# EAGLE design 477 (EAGLE 9.3.2)
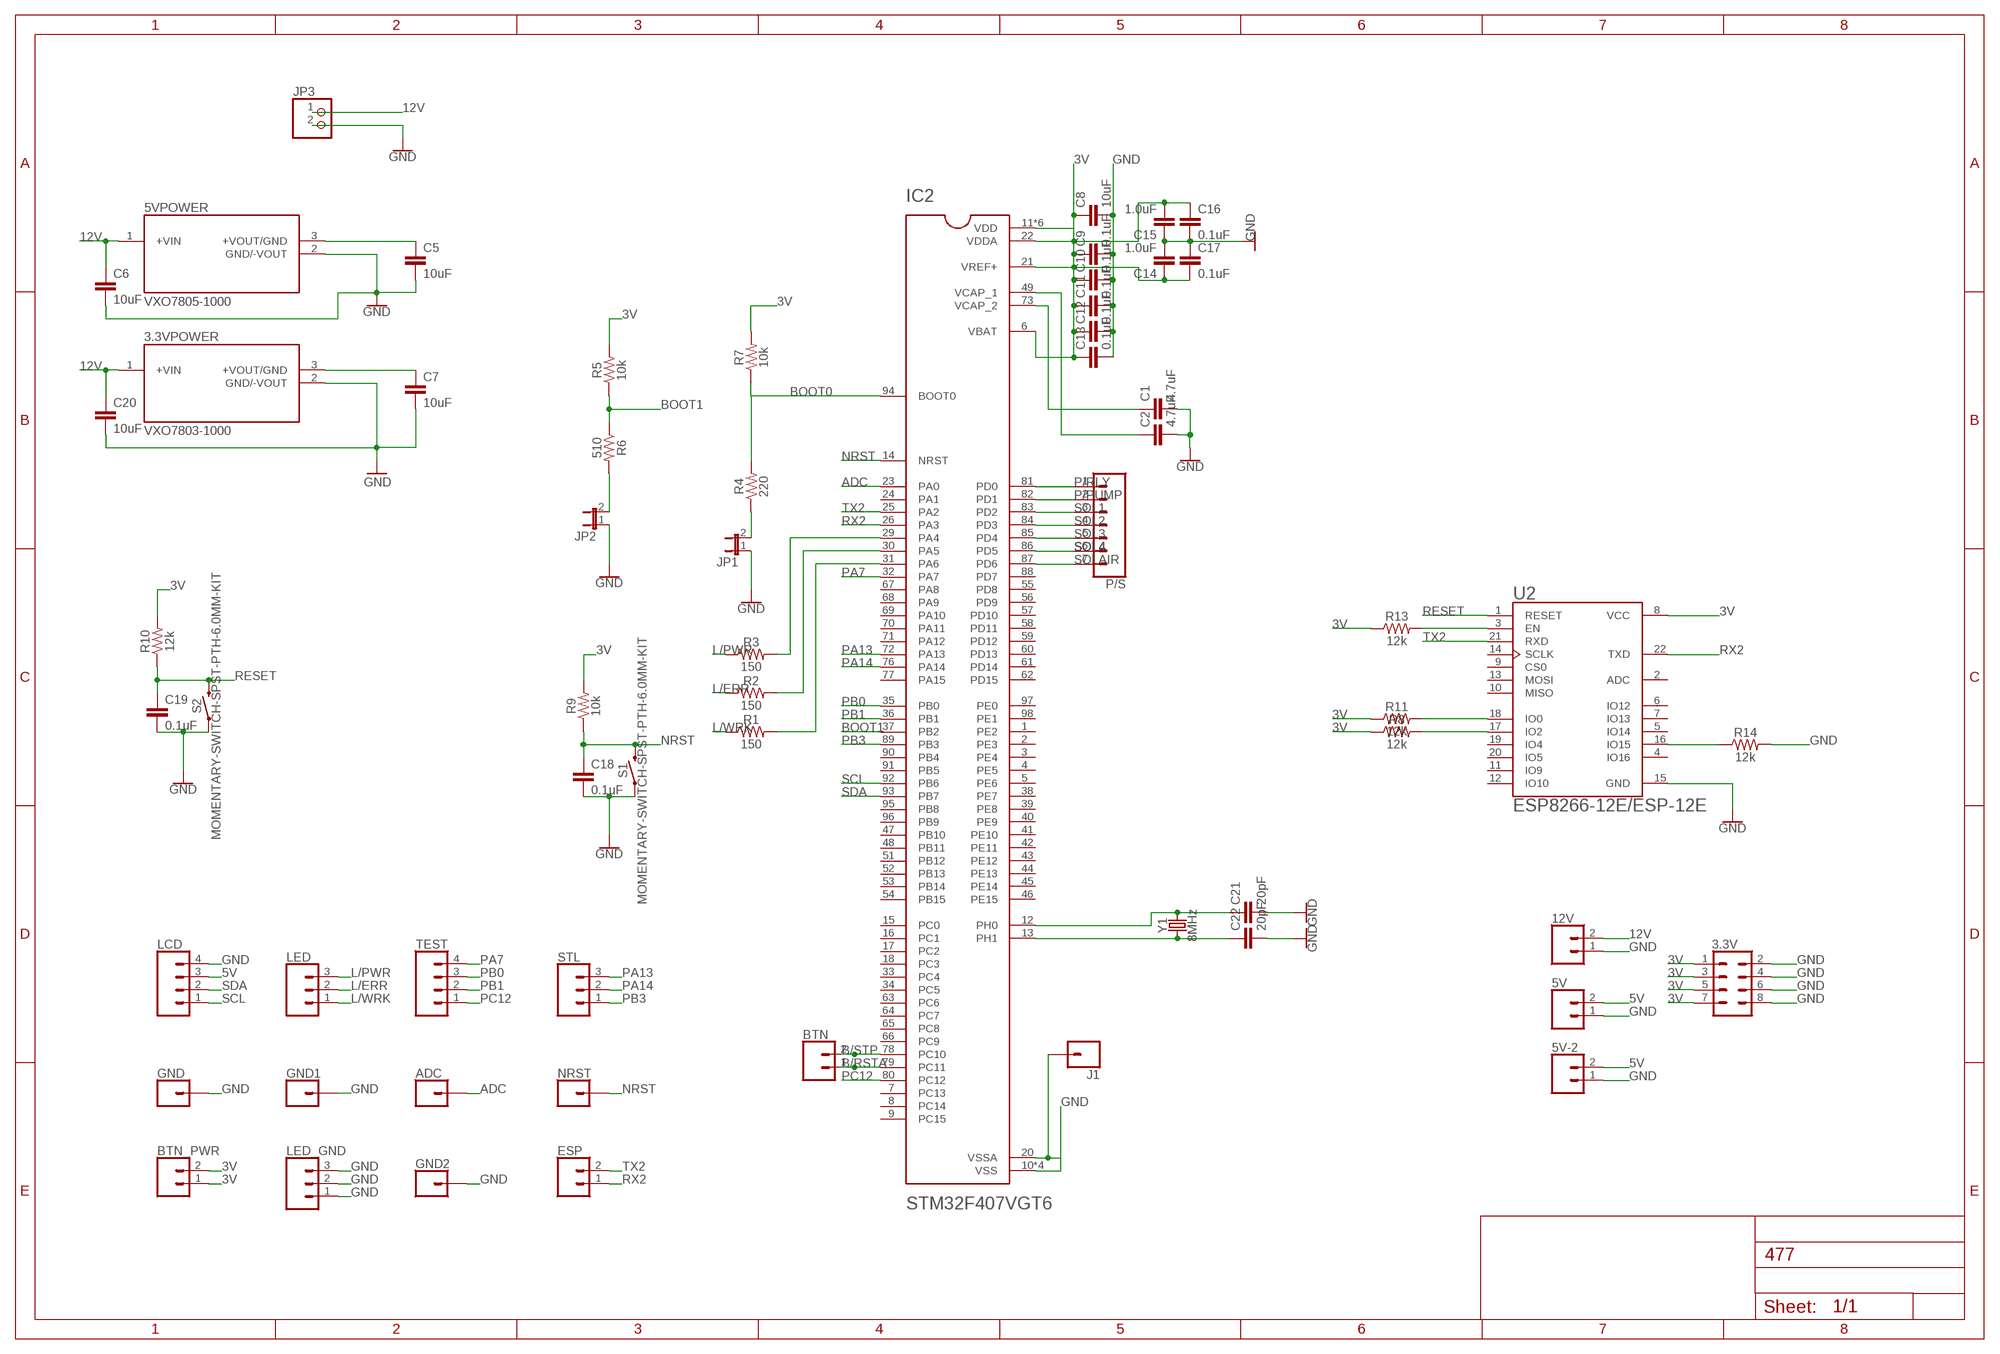
[diagram p0: schematic, sheet 1]

## Parts
3.3V  CONN_04X2  [2X4]
3.3VPOWER  VXO7803-1000  [CONV_VXO7803-1000]
5V  CONN_02  [1X02]
5V-2  CONN_02  [1X02]
5VPOWER  VXO7805-1000  [CONV_VXO7805-1000]
12V  CONN_02  [1X02]
ADC  CONN_01  [1X01]
BTN  CONN_02  [1X02]
BTN_PWR  CONN_02  [1X02]
C1  4.7uF  4.7UF0603  [0603]
C2  4.7uF  4.7UF0603  [0603]
C5  10uF  10UF-0603-6.3V-20%  [0603]
C6  10uF  10UF-0603-6.3V-20%  [0603]
C7  10uF  10UF-0603-6.3V-20%  [0603]
C8  10uF  10UF-0603-6.3V-20%  [0603]
C9  0.1uF  0.1UF-0402-16V-10%  [0402]
C10  0.1uF  0.1UF-0402-16V-10%  [0402]
C11  0.1uF  0.1UF-0402-16V-10%  [0402]
C12  0.1uF  0.1UF-0402-16V-10%  [0402]
C13  0.1uF  0.1UF-0402-16V-10%  [0402]
C14  1.0uF  1.0UF-0402-16V-10%  [0402]
C15  1.0uF  1.0UF-0402-16V-10%  [0402]
C16  0.1uF  0.1UF-0402-16V-10%  [0402]
C17  0.1uF  0.1UF-0402-16V-10%  [0402]
C18  0.1uF  0.1UF-0402-16V-10%  [0402]
C19  0.1uF  0.1UF-0402-16V-10%  [0402]
C20  10uF  10UF-0603-6.3V-20%  [0603]
C21  20pF  18PF-0603-50V-5%  [0603]
C22  20pF  18PF-0603-50V-5%  [0603]
ESP  CONN_02  [1X02]
GND  CONN_01PTH_NO_SILK_YES_STOP  [1X01_NO_SILK]
GND1  CONN_01PTH_NO_SILK_YES_STOP  [1X01_NO_SILK]
GND2  CONN_01  [1X01]
IC2  STM32F407VGT6  [QFP50P1600X1600X160-100N]
J1  CONN_01PTH_NO_SILK_YES_STOP  [1X01_NO_SILK]
JP1  JP1E  [JP1]
JP2  JP1E  [JP1]
JP3  PINHD-1X2  [1X02]
LCD  CONN_04  [1X04]
LED  CONN_03  [1X03]
LED_GND  CONN_03  [1X03]
NRST  CONN_01  [1X01]
P/S  CONN_07  [1X07]
R1  150  150OHM-0603-1/10W-1%  [0603]
R2  150  150OHM-0603-1/10W-1%  [0603]
R3  150  150OHM-0603-1/10W-1%  [0603]
R4  220  220OHM-0603-1/10W-1%  [0603]
R5  10k  1KOHM-0603-1/10W-1%  [0603]
R6  510  0.05OHM-0603-1/5W-1%  [0603]
R7  10k  10KOHM-0603-1/10W-1%  [0603]
R8  12k  12KOHM-0603-1/10W-1%  [0603]
R9  10k  10KOHM-0603-1/10W-1%  [0603]
R10  12k  12KOHM-0603-1/10W-1%  [0603]
R11  12k  12KOHM-0603-1/10W-1%  [0603]
R13  12k  12KOHM-0603-1/10W-1%  [0603]
R14  12k  12KOHM-0603-1/10W-1%  [0603]
S1  MOMENTARY-SWITCH-SPST-PTH-6.0MM-KIT  [TACTILE_SWITCH_PTH_6.0MM_KIT]
S2  MOMENTARY-SWITCH-SPST-PTH-6.0MM-KIT  [TACTILE_SWITCH_PTH_6.0MM_KIT]
STL  CONN_03  [1X03]
TEST  CONN_04  [1X04]
U2  ESP8266-12E/ESP-12E  [XCVR_ESP8266-12E/ESP-12E]
Y1  8MHz  CRYSTAL-8MHZSMD-HC49UP  [HC49UP]

## Nets
3V: 3.3V.1 3.3V.3 3.3V.5 3.3V.7 3.3VPOWER.3(+VOUT/GND) BTN_PWR.1 BTN_PWR.2 C7.1 C8.1 C9.1 C10.1 C11.1 C12.1 C13.1 C14.1 C15.2 C16.1 C17.2 IC2.6(VBAT) IC2.11(VDD) IC2.19(VDD) IC2.21(VREF+) IC2.22(VDDA) IC2.28(VDD) IC2.50(VDD) IC2.75(VDD) IC2.100(VDD) R5.2 R7.2 R8.1 R9.2 R10.2 R11.1 R13.1 U2.8(VCC)
5V: 5V-2.2 5V.2 5VPOWER.3(+VOUT/GND) C5.1 LCD.3
12V: 3.3VPOWER.1(+VIN) 5VPOWER.1(+VIN) 12V.2 C6.1 C20.1 JP3.1
ADC [sig]: ADC.1 IC2.23(PA0)
B/RSTA [sig]: BTN.1 IC2.79(PC11)
B/STP [sig]: BTN.2 IC2.78(PC10)
BOOT0 [sig]: IC2.94(BOOT0) R4.2 R7.1
BOOT1 [sig]: IC2.37(PB2) R5.1 R6.1
EN: R13.2 U2.3(EN)
GND: 3.3V.2 3.3V.4 3.3V.6 3.3V.8 3.3VPOWER.2(GND/-VOUT) 5V-2.1 5V.1 5VPOWER.2(GND/-VOUT) 12V.1 C1.2 C2.2 C5.2 C6.2 C7.2 C8.2 C9.2 C10.2 C11.2 C12.2 C13.2 C14.2 C15.1 C16.2 C17.1 C18.2 C19.2 C20.2 C21.2 C22.2 GND1.1 GND2.1 GND.1 IC2.10(VSS) IC2.27(VSS) IC2.74(VSS) IC2.99(VSS) JP1.1 JP2.1 JP3.2 LCD.4 LED_GND.1 LED_GND.2 LED_GND.3 R14.2 S1.1 S2.1 U2.15(GND)
L/ERR [sig]: LED.2 R2.1
L/PWR [sig]: LED.3 R3.1
L/WRK [sig]: LED.1 R1.1
N$1: IC2.29(PA4) R3.2
N$2: IC2.30(PA5) R2.2
N$3 [sig]: C22.1 IC2.13(PH1) Y1.1
N$4: IC2.31(PA6) R1.2
N$5: R11.2 U2.18(IO0)
N$6: R8.2 U2.17(IO2)
N$7: R14.1 U2.16(IO15)
N$10 [sig]: C21.1 IC2.12(PH0) Y1.2
N$15 [sig]: C1.1 IC2.73(VCAP_2)
N$16: JP2.2 R6.2
N$17 [sig]: C2.1 IC2.49(VCAP_1)
N$19: IC2.20(VSSA) J1.1
N$23: JP1.2 R4.1
NRST: C18.1 IC2.14(NRST) NRST.1 R9.1 S1.3
P/PUMP [sig]: IC2.82(PD1) P/S.2
P/RLY: IC2.81(PD0) P/S.1
PA7: IC2.32(PA7) TEST.4
PA13: IC2.72(PA13) STL.3
PA14: IC2.76(PA14) STL.2
PB0 [sig]: IC2.35(PB0) TEST.3
PB1 [sig]: IC2.36(PB1) TEST.2
PB3: IC2.89(PB3) STL.1
PC12: IC2.80(PC12) TEST.1
RESET: C19.1 R10.1 S2.3 U2.1(RESET)
RX2: ESP.1 IC2.26(PA3) U2.22(TXD)
SCL [sig]: IC2.92(PB6) LCD.1
SDA [sig]: IC2.93(PB7) LCD.2
SOL1 [sig]: IC2.83(PD2) P/S.3
SOL2 [sig]: IC2.84(PD3) P/S.4
SOL3 [sig]: IC2.85(PD4) P/S.5
SOL4 [sig]: IC2.86(PD5) P/S.6
SOLAIR [sig]: IC2.87(PD6) P/S.7
TX2: ESP.2 IC2.25(PA2) U2.21(RXD)
Unconnected: IC2.1(PE2) IC2.2(PE3) IC2.3(PE4) IC2.4(PE5) IC2.5(PE6) IC2.7(PC13) IC2.8(PC14) IC2.9(PC15) IC2.15(PC0) IC2.16(PC1) IC2.17(PC2) IC2.18(PC3) IC2.24(PA1) IC2.33(PC4) IC2.34(PC5) IC2.38(PE7) IC2.39(PE8) IC2.40(PE9) IC2.41(PE10) IC2.42(PE11) IC2.43(PE12) IC2.44(PE13) IC2.45(PE14) IC2.46(PE15) IC2.47(PB10) IC2.48(PB11) IC2.51(PB12) IC2.52(PB13) IC2.53(PB14) IC2.54(PB15) IC2.55(PD8) IC2.56(PD9) IC2.57(PD10) IC2.58(PD11) IC2.59(PD12) IC2.60(PD13) IC2.61(PD14) IC2.62(PD15) IC2.63(PC6) IC2.64(PC7) IC2.65(PC8) IC2.66(PC9) IC2.67(PA8) IC2.68(PA9) IC2.69(PA10) IC2.70(PA11) IC2.71(PA12) IC2.77(PA15) IC2.88(PD7) IC2.90(PB4) IC2.91(PB5) IC2.95(PB8) IC2.96(PB9) IC2.97(PE0) IC2.98(PE1) U2.2(ADC) U2.4(IO16) U2.5(IO14) U2.6(IO12) U2.7(IO13) U2.9(CS0) U2.10(MISO) U2.11(IO9) U2.12(IO10) U2.13(MOSI) U2.14(SCLK) U2.19(IO4) U2.20(IO5)

## Library data of the parts
3.3V = SparkFun-Connectors:CONN_04X2: Multi connection point. Often used as Generic Header-pin footprint for 0.1 inch spaced/style header connections On any of the 0.1 inch spaced packages, you can populate with these: Break Away Headers - Straight <https://www.sparkfun.com/products/116> (PRT-00116) Break Away Male Headers - Right Angle <https://www.sparkfun.com/products/553> (PRT-00553) Female Headers <https://www.sparkfun.com/products/115> (PRT-00115) Break Away Headers - Machine Pin <https://www.sparkfun.com/products/117> (PRT-00117) Break Away Female Headers - Swiss Machine Pin <https://www.sparkfun.com/products/743> (PRT-00743)
3.3VPOWER = VXO7803-1000:VXO7803-1000; AVAILABILITY: Unavailable; CUI_PURCHASE_URL: https://www.cui.com/product/power/dc-dc-converters/non-isolated/vxo78-1000-series?utm_source=snapeda.com&utm_medium=referral&utm_campaign=snapedaBOM; DESCRIPTION: VXO78-1000 Series 24 Vin 3.3 Vout Non-Isolated Open Frame DC Switching Regulator; MF: CUI Inc.; MP: VXO7803-1000; PACKAGE: SIP-3 CUI; PRICE: None
5V 5V-2 12V BTN BTN_PWR ESP = SparkFun-Connectors:CONN_02: Multi connection point. Often used as Generic Header-pin footprint for 0.1 inch spaced/style header connections On any of the 0.1 inch spaced packages, you can populate with these: Break Away Headers - Straight <https://www.sparkfun.com/products/116> (PRT-00116) Break Away Male Headers - Right Angle <https://www.sparkfun.com/products/553> (PRT-00553) Female Headers <https://www.sparkfun.com/products/115> (PRT-00115) Break Away Headers - Machine Pin <https://www.sparkfun.com/products/117> (PRT-00117) Break Away Female Headers - Swiss Machine Pin <https://www.sparkfun.com/products/743> (PRT-00743) For SCREWTERMINALS and SPRING TERMINALS visit here: Screw Terimnals on SparkFun.com <https://www.sparkfun.com/search/results?term=Screw+Terminals> (5mm/3.5mm/2.54mm spacing) This device is also useful as a general connection point to wire up your design to another part of your project. Our various solder wires solder well into these plated through hole pads. Hook-Up Wire - Assortment (Stranded, 22 AWG) <https://www.sparkfun.com/products/11375> (PRT-11375) Hook-Up Wire - Assortment (Solid Core, 22 AWG) <https://www.sparkfun.com/products/11367> (PRT-11367) View the entire wire category on our website here <https://www.sparkfun.com/categories/141> Special notes: Molex polarized connector foot print use with: PRT-08233 with associated crimp pins and housings. 2.54_SCREWTERM for use with PRT-10571. 3.5mm Screw Terminal footprints for PRT-08084 5mm Screw Terminal footprints for use with PRT-08432
5VPOWER = VXO7805-1000:VXO7805-1000; AVAILABILITY: Unavailable; CUI_PURCHASE_URL: https://www.cui.com/product/power/dc-dc-converters/non-isolated/vxo78-1000-series?utm_source=snapeda.com&utm_medium=referral&utm_campaign=snapedaBOM; DESCRIPTION: VXO78-1000 Series 24 / 12 Vin ±5 Vout Non-Isolated DC Switching Regulator; MF: CUI Inc.; MP: VXO7805-1000; PACKAGE: SIP-3 CUI; PRICE: None
ADC GND GND1 GND2 J1 NRST = SparkFun-Connectors:CONN_01: Single connection point. Often used as Generic Header-pin footprint for 0.1 inch spaced/style header connections On any of the 0.1 inch spaced packages, you can populate with these: Break Away Headers - Straight <https://www.sparkfun.com/products/116> (PRT-00116) Break Away Male Headers - Right Angle <https://www.sparkfun.com/products/553> (PRT-00553) Female Headers <https://www.sparkfun.com/products/115> (PRT-00115) Break Away Headers - Machine Pin <https://www.sparkfun.com/products/117> (PRT-00117) Break Away Female Headers - Swiss Machine Pin <https://www.sparkfun.com/products/743> (PRT-00743) This device is also useful as a general connection point to wire up your design to another part of your project. Our various solder wires solder well into these plated through hole pads. Hook-Up Wire - Assortment (Stranded, 22 AWG) <https://www.sparkfun.com/products/11375> (PRT-11375) Hook-Up Wire - Assortment (Solid Core, 22 AWG) <https://www.sparkfun.com/products/11367> (PRT-11367) View the entire wire category on our website here <https://www.sparkfun.com/categories/141> Special notes: SMTSO-256-ET is a "flush mount" nut for a 4-40 screw. We mostly use this on specialty testbeds; it is a nice way to connect hardware to your PCB at an adjustable hieght. Also note, the SNAP packages are for using a snappable style connector. We sell a baggie of snaps and they are also used on two LilyPad designs: Snap Assortment - 30 pack (male and female) <https://www.sparkfun.com/products/11347> (DEV-11347) LilyPad Arduino SimpleSnap <https://www.sparkfun.com/products/10941> (DEV-10941) LilyPad SimpleSnap Protoboard <https://www.sparkfun.com/products/10940> (DEV-10940)
C1 C2 = SparkFun-Capacitors:4.7UF: 4.7µF ceramic capacitors A capacitor is a passive two-terminal electrical component used to store electrical energy temporarily in an electric field.; PROD_ID: CAP-08280
C5-C8 C20 = SparkFun-Capacitors:10UF: 10.0µF ceramic capacitors A capacitor is a passive two-terminal electrical component used to store electrical energy temporarily in an electric field.; PROD_ID: CAP-11015
C9-C13 C16-C19 = SparkFun-Capacitors:0.1UF: 0.1µF ceramic capacitors A capacitor is a passive two-terminal electrical component used to store electrical energy temporarily in an electric field.; PROD_ID: CAP-12416
C14 C15 = SparkFun-Capacitors:1.0UF: 1µF ceramic capacitors A capacitor is a passive two-terminal electrical component used to store electrical energy temporarily in an electric field.; PROD_ID: CAP-12417
C21 C22 = SparkFun-Capacitors:18PF: 18pF ceramic capacitors A capacitor is a passive two-terminal electrical component used to store electrical energy temporarily in an electric field.; PROD_ID: CAP-08267; VALUE: 18pF
IC2 = STM32F407VGT6:STM32F407VGT6: STM32 Series 32-bit 1 MB Flash 192 kB RAM ARM Based Microcontroller - LQFP-100; AVAILABILITY: Unavailable; DESCRIPTION: STM32 Series 32-bit 1 MB Flash 192 kB RAM ARM Based Microcontroller - LQFP-100; MF: STMicroelectronics; MP: STM32F407VGT6; PACKAGE: LQFP-100 STMicroelectronics; PRICE: None
JP1 JP2 = jumper:JP1E: JUMPER
JP3 = pinhead:PINHD-1X2: PIN HEADER
LCD TEST = SparkFun-Connectors:CONN_04: Multi connection point. Often used as Generic Header-pin footprint for 0.1 inch spaced/style header connections On any of the 0.1 inch spaced packages, you can populate with these: Break Away Headers - Straight <https://www.sparkfun.com/products/116> (PRT-00116) Break Away Male Headers - Right Angle <https://www.sparkfun.com/products/553> (PRT-00553) Female Headers <https://www.sparkfun.com/products/115> (PRT-00115) Break Away Headers - Machine Pin <https://www.sparkfun.com/products/117> (PRT-00117) Break Away Female Headers - Swiss Machine Pin <https://www.sparkfun.com/products/743> (PRT-00743) For SCREWTERMINALS and SPRING TERMINALS visit here: Screw Terimnals on SparkFun.com <https://www.sparkfun.com/search/results?term=Screw+Terminals> (5mm/3.5mm/2.54mm spacing) This device is also useful as a general connection point to wire up your design to another part of your project. Our various solder wires solder well into these plated through hole pads. Hook-Up Wire - Assortment (Stranded, 22 AWG) <https://www.sparkfun.com/products/11375> (PRT-11375) Hook-Up Wire - Assortment (Solid Core, 22 AWG) <https://www.sparkfun.com/products/11367> (PRT-11367) View the entire wire category on our website here <https://www.sparkfun.com/categories/141> Special notes: Molex polarized connector foot print use with SKU : PRT-08231 with associated crimp pins and housings. 1MM SMD Version SKU: PRT-10208; PROD_ID: CONN-09696
LED LED_GND STL = SparkFun-Connectors:CONN_03: Multi connection point. Often used as Generic Header-pin footprint for 0.1 inch spaced/style header connections On any of the 0.1 inch spaced packages, you can populate with these: Break Away Headers - Straight <https://www.sparkfun.com/products/116> (PRT-00116) Break Away Male Headers - Right Angle <https://www.sparkfun.com/products/553> (PRT-00553) Female Headers <https://www.sparkfun.com/products/115> (PRT-00115) Break Away Headers - Machine Pin <https://www.sparkfun.com/products/117> (PRT-00117) Break Away Female Headers - Swiss Machine Pin <https://www.sparkfun.com/products/743> (PRT-00743) Stackable Header - 3 Pin (Female, 0.1") <https://www.sparkfun.com/products/13875> (PRT-13875) For SCREWTERMINALS and SPRING TERMINALS visit here: Screw Terimnals on SparkFun.com <https://www.sparkfun.com/search/results?term=Screw+Terminals> (5mm/3.5mm/2.54mm spacing) This device is also useful as a general connection point to wire up your design to another part of your project. Our various solder wires solder well into these plated through hole pads. Hook-Up Wire - Assortment (Stranded, 22 AWG) <https://www.sparkfun.com/products/11375> (PRT-11375) Hook-Up Wire - Assortment (Solid Core, 22 AWG) <https://www.sparkfun.com/products/11367> (PRT-11367) View the entire wire category on our website here <https://www.sparkfun.com/categories/141> Special notes: Molex polarized connector foot print use with SKU : PRT-08232 with associated crimp pins and housings.
P/S = SparkFun-Connectors:CONN_07: Multi connection point. Often used as Generic Header-pin footprint for 0.1 inch spaced/style header connections On any of the 0.1 inch spaced packages, you can populate with these: Break Away Headers - Straight <https://www.sparkfun.com/products/116> (PRT-00116) Break Away Male Headers - Right Angle <https://www.sparkfun.com/products/553> (PRT-00553) Female Headers <https://www.sparkfun.com/products/115> (PRT-00115) Break Away Headers - Machine Pin <https://www.sparkfun.com/products/117> (PRT-00117) Break Away Female Headers - Swiss Machine Pin <https://www.sparkfun.com/products/743> (PRT-00743) For SCREWTERMINALS and SPRING TERMINALS visit here: Screw Terimnals on SparkFun.com <https://www.sparkfun.com/search/results?term=Screw+Terminals> (5mm/3.5mm/2.54mm spacing) This device is also useful as a general connection point to wire up your design to another part of your project. Our various solder wires solder well into these plated through hole pads. Hook-Up Wire - Assortment (Stranded, 22 AWG) <https://www.sparkfun.com/products/11375> (PRT-11375) Hook-Up Wire - Assortment (Solid Core, 22 AWG) <https://www.sparkfun.com/products/11367> (PRT-11367) View the entire wire category on our website here <https://www.sparkfun.com/categories/141> Special notes: Molex polarized connector foot print use with SKU : PRT-08231 with associated crimp pins and housings. 1MM SMD Version SKU: PRT-10208 NOTES ON THE VARIANTS LOCK and LOCK_LONGPADS... This footprint was designed to help hold the alignment of a through-hole component (i.e. 6-pin header) while soldering it into place. You may notice that each hole has been shifted either up or down by 0.005 of an inch from it's more standard position (which is a perfectly straight line). This slight alteration caused the pins (the squares in the middle) to touch the edges of the holes. Because they are alternating, it causes a "brace" to hold the component in place. 0.005 has proven to be the perfect amount of "off-center" position when using our standard breakaway headers. Although looks a little odd when you look at the bare footprint, once you have a header in there, the alteration is very hard to notice. Also,if you push a header all the way into place, it is covered up entirely on the bottom side.
R1-R3 = SparkFun-Resistors:150OHM: 150Ω resistor A resistor is a passive two-terminal electrical component that implements electrical resistance as a circuit element. Resistors act to reduce current flow, and, at the same time, act to lower voltage levels within circuits. - Wikipedia; PROD_ID: RES-11028
R4 = SparkFun-Resistors:220OHM: 220Ω resistor A resistor is a passive two-terminal electrical component that implements electrical resistance as a circuit element. Resistors act to reduce current flow, and, at the same time, act to lower voltage levels within circuits. - Wikipedia; PROD_ID: RES-07861
R5 = SparkFun-Resistors:1KOHM: 1kΩ resistor A resistor is a passive two-terminal electrical component that implements electrical resistance as a circuit element. Resistors act to reduce current flow, and, at the same time, act to lower voltage levels within circuits. - Wikipedia; PROD_ID: RES-07856; VALUE: 1k
R6 = SparkFun-Resistors:0.05OHM: 0.05Ω resistor A resistor is a passive two-terminal electrical component that implements electrical resistance as a circuit element. Resistors act to reduce current flow, and, at the same time, act to lower voltage levels within circuits. - Wikipedia; PROD_ID: RES-12535; VALUE: 0.05
R7 R9 = SparkFun-Resistors:10KOHM: 10kΩ resistor A resistor is a passive two-terminal electrical component that implements electrical resistance as a circuit element. Resistors act to reduce current flow, and, at the same time, act to lower voltage levels within circuits. - Wikipedia; PROD_ID: RES-00824
R8 R10 R11 R13 R14 = SparkFun-Resistors:12KOHM: 12kΩ resistor A resistor is a passive two-terminal electrical component that implements electrical resistance as a circuit element. Resistors act to reduce current flow, and, at the same time, act to lower voltage levels within circuits. - Wikipedia; PROD_ID: RES-10327
S1 S2 = SparkFun-Switches:MOMENTARY-SWITCH-SPST: Momentary Switch (Pushbutton) - SPST Normally-open (NO) SPST momentary switches (buttons, pushbuttons). Variants PTH-12MM - 12mm square, through-hole Momentary Pushbutton Switch - 12mm Square <https://www.sparkfun.com/products/9190> (COM-09190) PTH-6.0MM, PTH-6.0MM-KIT - 6.0mm square, through-hole Mini Pushbutton Switch <https://www.sparkfun.com/products/97> (COM-00097) KIT package intended for soldering kit's - only one side of pads' copper is exposed. PTH-RIGHT-ANGLE-KIT - Right-angle, through-hole Right Angle Tactile Button <https://www.sparkfun.com/products/10791> - Used on SparkFun BigTime Watch Kit <https://www.sparkfun.com/products/11734> SMD-12MM - 12mm square, surface-mount Tactile Button - SMD (12mm) <https://www.sparkfun.com/products/12993> (COM-12993) Used on SparkFun PicoBoard <https://www.sparkfun.com/products/11888> SMD-4.5MM - 4.5mm Square Trackball Switch Used on SparkFun Blackberry Trackballer Breakout <https://www.sparkfun.com/products/13169> SMD-4.6MMX2.8MM - 4.60mm x 2.80mm, surface mount Used on SparkFun SAMD21 Mini Breakout <https://www.sparkfun.com/products/13664> SMD-5.2MM, SMD-5.2-REDUNDANT - 5.2mm square, surface-mount Mini Pushbutton Switch - SMD <https://www.sparkfun.com/products/8720> (COM-08720) Used on Arduino Pro Mini <https://www.sparkfun.com/products/11114> REDUNDANT package connects both switch circuits together SMD-6.0X3.5MM - 6.0 x 3.5mm, surface mount Momentary Reset Switch SMD <https://www.sparkfun.com/products/8229> (COM-08229) SMD-6.2MM-TALL - 6.2mm square, surface mount Tactile Button - SMD (6mm) <https://www.sparkfun.com/products/12992> Used on SparkFun Digital Sandbox <https://www.sparkfun.com/products/12651> SMD-RIGHT-ANGLE - Right-angle, surface mount Used on SparkFun Block for Intel® Edison - Arduino <https://www.sparkfun.com/products/13036>; PROD_ID: SWCH-08441; SF_SKU: COM-00097
U2 = ESP8266-12E_ESP-12E:ESP8266-12E/ESP-12E: ESP-12E WiFi Module; AVAILABILITY: Unavailable; DESCRIPTION: This WiFi module has a 32-bit MCU micro and clock speeds supporting 80 MHz or 160 MHz. Supports the RTOS and integrated Wi-Fi MAC/BB/RF/PA/LNA, and has an on-board antenna.; MF: AI-Thinker; MP: ESP8266-12E/ESP-12E; PACKAGE: None; PRICE: None
Y1 = SparkFun-Clocks:CRYSTAL-8MHZ: 8MHz Crystal Datasheet Example <http://www.futureelectronics.com/en/technologies/electromechanical/timing-devices/crystals/Pages/6008189-ABM3B-8.000MHZ-B2-T.aspx?IM=0> Frequency: 8MHz Frequency Tolerance: ±20ppm Load Capacitance: 18pF SparkFun Products: Pro Micro -3.3V/8MHz <https://www.sparkfun.com/products/12587> WAV Trigger <https://www.sparkfun.com/products/13660>; PROD_ID: XTAL-11706

## Net classes
0 default: width 0.152 mm, drill 0.508 mm, clearance 0.254 mm
1 sig: width 0.152 mm, drill 0.152 mm, clearance 0.076 mm

## Board
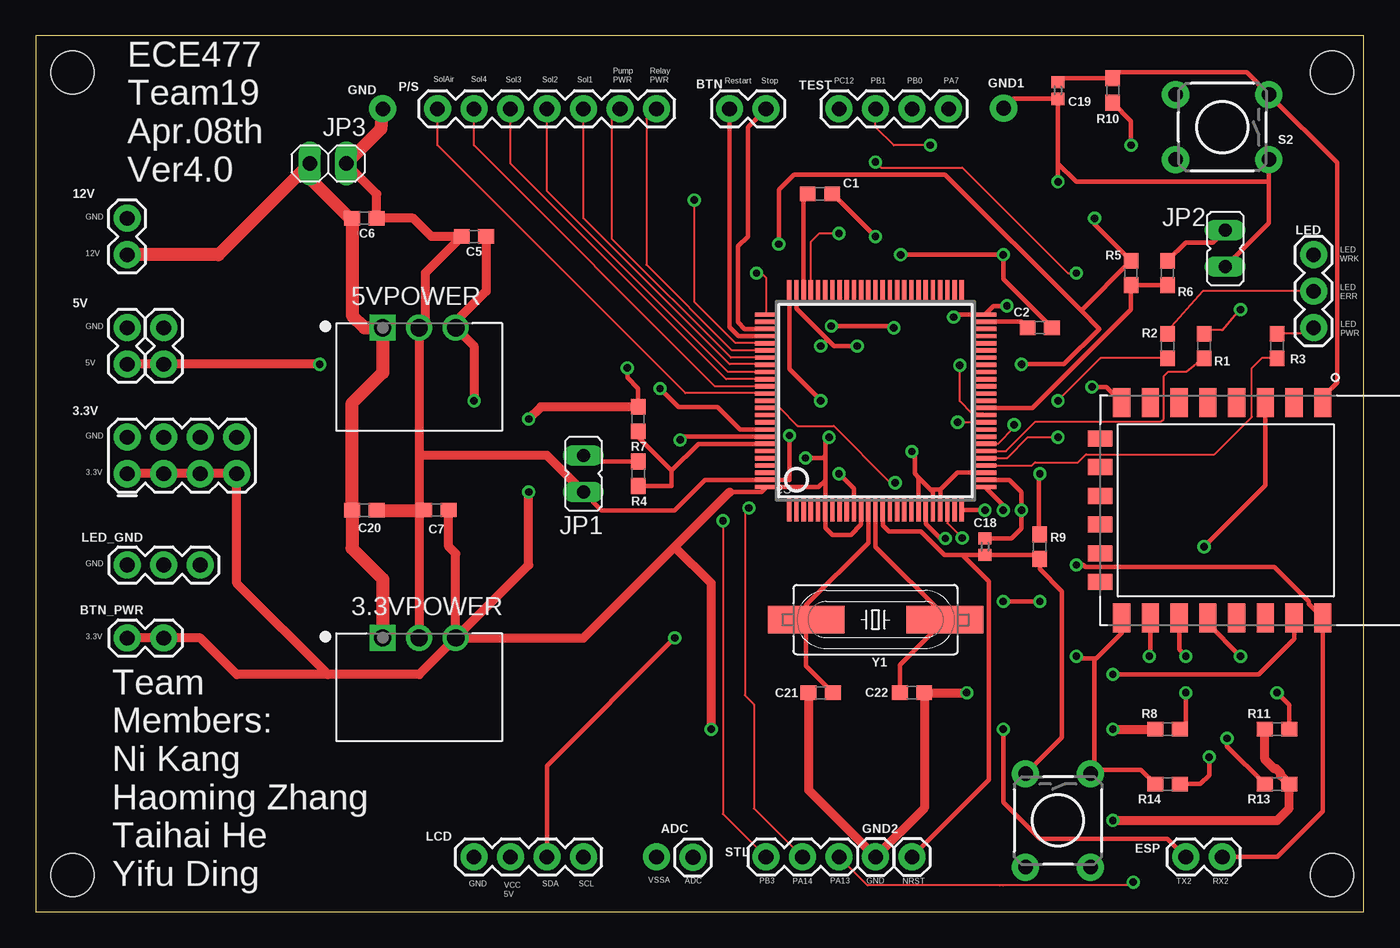
[diagram p1: board, top side]
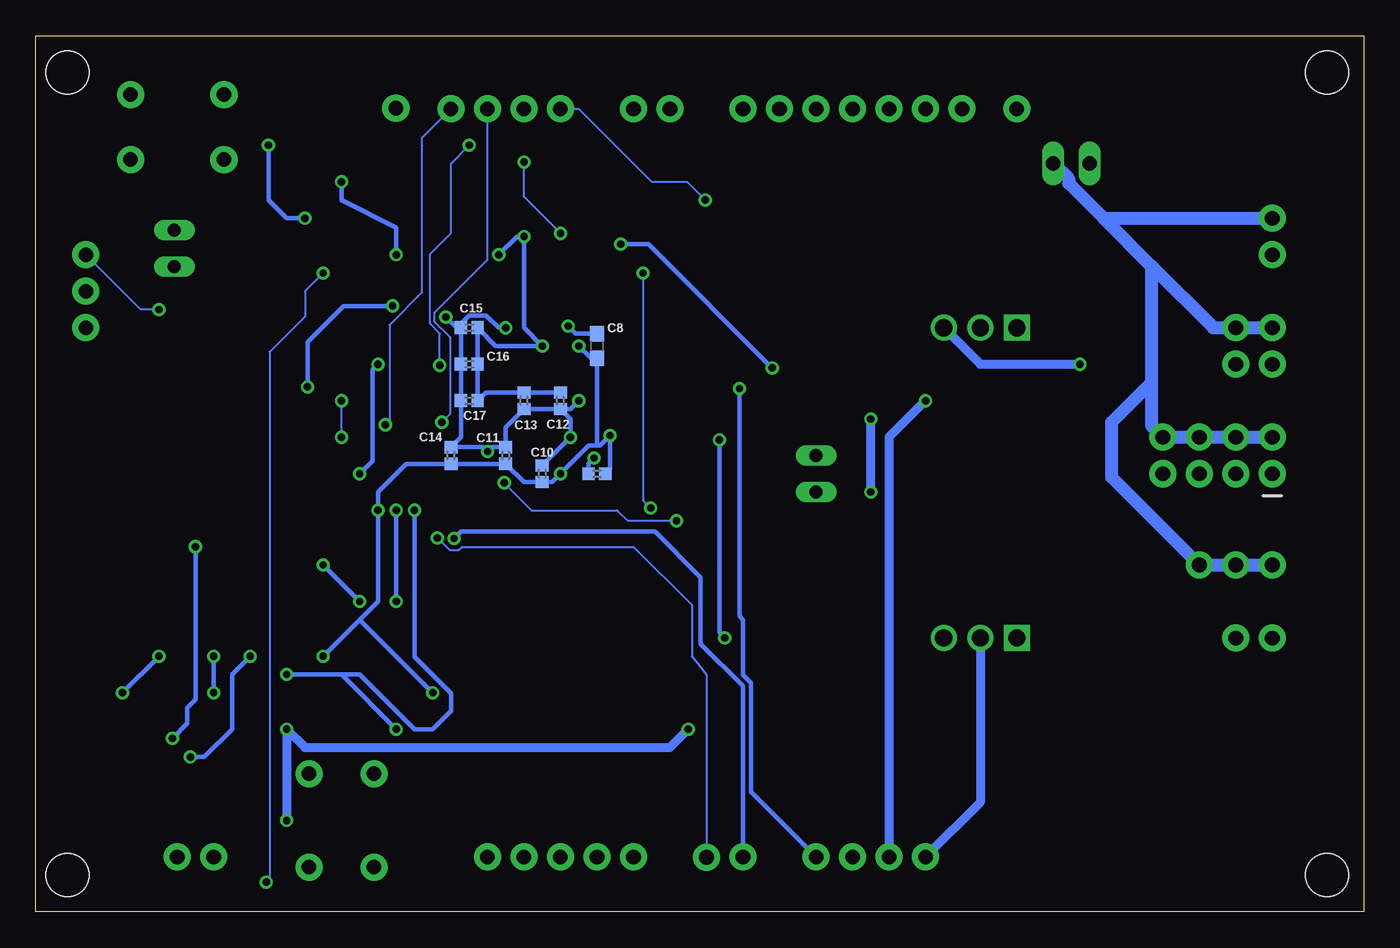
[diagram p2: board, bottom side, seen from below]

Size 92.38 x 60.95 mm. Coordinates in mm from the lower left corner, seen from the top.
Outline: 0,0 92.38,0 92.38,60.95 0,60.95 0,0
Copper layers (1*16): Top 0.035mm / dielectric 1.5mm / Bottom 0.035mm
Design rules "default": minimum track width 6mil, minimum drill 0.35mm, track to track 6mil, track to pad 6mil, pad to pad 6mil, via to via 6mil, smd to smd 6mil, copper to edge 40mil, drill to drill 6mil, minimum pad ring 10mil, minimum via ring 8mil, stop-mask expansion 4mil, vias tented up to drill 0mil, thermal gap 10mil
Holes 3 mm at 90.17,2.54 90.17,58.42 2.54,58.42 2.54,2.54

### Footprints (pad centres in the part's own frame; a part is rotated, then mirrored left to right if it is on the bottom)
2X4 = drill 1.016 pad 1.88: 1 -3.81,-1.27; 2 -3.81,1.27; 3 -1.27,-1.27; 4 -1.27,1.27; 5 1.27,-1.27; 6 1.27,1.27; 7 3.81,-1.27; 8 3.81,1.27
CONV_VXO7803-1000 = drill 1.2 square: 1 0,0 | drill 1.2: 2 2.54,0; 3 5.08,0
1X02 = drill 1.016 pad 1.88: 1 0,0; 2 2.54,0
CONV_VXO7805-1000 = drill 1.2 square: 1 0,0 | drill 1.2: 2 2.54,0; 3 5.08,0
1X01 = drill 1.016 pad 1.88: 1 0,0
0603 = smd 1.1 x 1: 1 -0.85,0; 2 0.85,0
0402 = smd 0.85 x 0.9: 1 -0.58,0; 2 0.58,0
1X01_NO_SILK = drill 1.016 pad 1.88: 1 0,0
QFP50P1600X1600X160-100N = smd 0.3 x 1.6: 1 -6,-7.6; 2 -5.5,-7.6; 3 -5,-7.6; 4 -4.5,-7.6; 5 -4,-7.6; 6 -3.5,-7.6; 7 -3,-7.6; 8 -2.5,-7.6; 9 -2,-7.6; 10 -1.5,-7.6; 11 -1,-7.6; 12 -0.5,-7.6; 13 0,-7.6; 14 0.5,-7.6; 15 1,-7.6; 16 1.5,-7.6; 17 2,-7.6; 18 2.5,-7.6; 19 3,-7.6; 20 3.5,-7.6; 21 4,-7.6; 22 4.5,-7.6; 23 5,-7.6; 24 5.5,-7.6; 25 6,-7.6; 51 6,7.6; 52 5.5,7.6; 53 5,7.6; 54 4.5,7.6; 55 4,7.6; 56 3.5,7.6; 57 3,7.6; 58 2.5,7.6; 59 2,7.6; 60 1.5,7.6; 61 1,7.6; 62 0.5,7.6; 63 0,7.6; 64 -0.5,7.6; 65 -1,7.6; 66 -1.5,7.6; 67 -2,7.6; 68 -2.5,7.6; 69 -3,7.6; 70 -3.5,7.6; 71 -4,7.6; 72 -4.5,7.6; 73 -5,7.6; 74 -5.5,7.6; 75 -6,7.6 | smd 1.6 x 0.3: 26 7.6,-6; 27 7.6,-5.5; 28 7.6,-5; 29 7.6,-4.5; 30 7.6,-4; 31 7.6,-3.5; 32 7.6,-3; 33 7.6,-2.5; 34 7.6,-2; 35 7.6,-1.5; 36 7.6,-1; 37 7.6,-0.5; 38 7.6,0; 39 7.6,0.5; 40 7.6,1; 41 7.6,1.5; 42 7.6,2; 43 7.6,2.5; 44 7.6,3; 45 7.6,3.5; 46 7.6,4; 47 7.6,4.5; 48 7.6,5; 49 7.6,5.5; 50 7.6,6; 76 -7.6,6; 77 -7.6,5.5; 78 -7.6,5; 79 -7.6,4.5; 80 -7.6,4; 81 -7.6,3.5; 82 -7.6,3; 83 -7.6,2.5; 84 -7.6,2; 85 -7.6,1.5; 86 -7.6,1; 87 -7.6,0.5; 88 -7.6,0; 89 -7.6,-0.5; 90 -7.6,-1; 91 -7.6,-1.5; 92 -7.6,-2; 93 -7.6,-2.5; 94 -7.6,-3; 95 -7.6,-3.5; 96 -7.6,-4; 97 -7.6,-4.5; 98 -7.6,-5; 99 -7.6,-5.5; 100 -7.6,-6
JP1 = drill 0.914 long: 1 0,-1.27; 2 0,1.27
1X02' = drill 1.016 long: 1 -1.27,0; 2 1.27,0
1X04 = drill 1.016 pad 1.88: 1 0,0; 2 2.54,0; 3 5.08,0; 4 7.62,0
1X03 = drill 1.016 pad 1.88: 1 0,0; 2 2.54,0; 3 5.08,0
1X07 = drill 1.016 pad 1.88: 1 0,0; 2 2.54,0; 3 5.08,0; 4 7.62,0; 5 10.16,0; 6 12.7,0; 7 15.24,0
TACTILE_SWITCH_PTH_6.0MM_KIT = drill 1.016 pad 1.88: 1 -3.251,2.261; 2 3.251,2.261; 3 -3.251,-2.261; 4 3.251,-2.261
XCVR_ESP8266-12E/ESP-12E = smd 2 x 1.2: 1 -7.5,7; 2 -7.5,5; 3 -7.5,3; 4 -7.5,1; 5 -7.5,-1; 6 -7.5,-3; 7 -7.5,-5; 8 -7.5,-7; 15 7.5,-7; 16 7.5,-5; 17 7.5,-3; 18 7.5,-1; 19 7.5,1; 20 7.5,3; 21 7.5,5; 22 7.5,7 | smd 1.1 x 1.7: 9 -5,-8.5; 10 -3,-8.5; 11 -1,-8.5; 12 1,-8.5; 13 3,-8.5; 14 5,-8.5
HC49UP = smd 5.334 x 1.93: 1 -4.826,0; 2 4.826,0

### Placement (x,y rotation side)
3.3V  10.16,31.75 0 top
3.3VPOWER  24.13,19.05 0 top
5V  6.35,40.64 270 top
5V-2  8.89,40.64 270 top
5VPOWER  24.13,40.64 0 top
12V  6.35,48.26 270 top
ADC  45.72,3.78 0 top
BTN  48.26,55.88 0 top
BTN_PWR  6.35,19.05 0 top
C1  54.55,49.95 0 top
C2  69.85,40.64 0 top
C5  30.48,46.99 180 top
C6  22.86,48.26 0 top
C7  27.87,27.96 180 top
C8  53.34,39.37 270 bottom
C9  53.34,30.48 0 bottom
C10  57.15,30.48 270 bottom
C11  59.69,31.75 270 bottom
C12  55.88,35.56 90 bottom
C13  58.42,35.56 90 bottom
C14  63.5,31.75 270 bottom
C15  62.23,40.64 180 bottom
C16  62.23,38.1 0 bottom
C17  62.23,35.56 180 bottom
C18  66.04,25.4 90 top
C19  71.12,57.15 270 top
C20  22.86,27.94 0 top
C21  54.61,15.24 180 top
C22  60.96,15.24 0 top
ESP  82.55,3.81 180 top
GND  24.13,55.88 0 top
GND1  67.34,55.92 0 top
GND2  58.42,3.81 0 top
IC2  58.42,35.56 0 top
J1  43.18,3.81 0 top
JP1  38.1,30.48 0 top
JP2  82.76,46.16 0 top
JP3  [1X02']  20.32,52.07 0 top
LCD  38.1,3.81 180 top
LED  88.9,45.72 270 top
LED_GND  6.35,24.13 0 top
NRST  60.96,3.81 0 top
P/S  43.18,55.88 180 top
R1  81.28,39.37 270 top
R2  78.74,39.37 270 top
R3  86.36,39.37 270 top
R4  41.91,30.48 270 top
R5  76.2,44.45 90 top
R6  78.74,44.45 90 top
R7  41.91,34.29 90 top
R8  78.74,12.7 0 top
R9  69.85,25.4 90 top
R10  74.93,57.15 270 top
R11  86.36,12.7 0 top
R13  86.36,8.89 180 top
R14  78.74,8.89 180 top
S1  71.12,6.35 270 top
S2  82.55,54.61 180 top
STL  50.8,3.81 0 top
TEST  55.88,55.88 0 top
U2  82.55,27.94 270 top
Y1  58.42,20.32 180 top

### Tracks (layer width: path | path; a pad name or v marks a point on that pad's centre or on a via)
3V  (via drill 0.51)
  Top 0.305: v73.48,36.52 74.47,36.52 75.44,35.56 U2.8 | 54.92,30.01 IC2.6 54.92,26.71 55.42,26.21 56.7,26.21 57.42,26.94 IC2.11 | 54.92,30.01 54.92,31.75 | 54.92,31.75 54.92,32.75 v55.19,33.02 | v60.96,32.03 61.15,31.84 61.15,30.48 61.42,30.21 | 48.26,29.21 50.47,29.21 IC2.100 54.47,29.56 54.92,30.01 | 61.42,30.21 62.26,29.37 | 62.26,29.37 62.92,29.37 | IC2.22 62.92,29.37 | IC2.19 61.42,30.21 | IC2.28 64.11,30.56 62.92,29.37 | v63.86,41.38 64.04,41.56 IC2.50 66.62,42.16 v67.56,42.16 | IC2.75 52.42,37.75 v54.61,35.56 | v55.35,40.76 59.57,40.76 v59.69,40.64 | IC2.21 62.42,29.21 62.26,29.37 | v53.54,31.58 54.75,31.58 54.92,31.75 | v76.2,53.34 76.2,55.03 R10.2 | v73.66,48.26 73.66,47.84 R5.2 72.73,41.83 | v68.58,38.1 71.54,38.1 74,40.56 72.73,41.83 | R7.2 41.91,36.41 41.15,37.17 v41.15,37.85 | v51.69,46.46 51.69,50.27 52.73,51.31 63.25,51.31 72.73,41.83 | R9.2 69.8,26.34 69.8,30.39 v69.85,30.48
  Top 0.61: 3.3VPOWER.3 29.21,24.92 28.72,25.42 C7.1 | 3.3VPOWER.3 38.1,19.05 44.45,25.4 | 44.45,25.4 48.26,29.21 | R7.2 35.14,35.14 v34.29,34.29 | v34.29,29.21 34.29,24.13 3.3VPOWER.3 | 3.3VPOWER.3 26.67,16.51 20.32,16.51 | 20.32,16.51 13.97,16.51 11.43,19.05 BTN_PWR.2 BTN_PWR.1 | 20.32,16.51 13.97,22.86 3.3V.7 3.3V.5 3.3V.3 3.3V.1 | v46.99,12.7 46.99,22.86 44.45,25.4 | v74.93,12.7 R8.1 | v74.93,6.35 86.36,6.35 87.21,7.2 R13.1 86.62,9.48 86.62,9.62 86.29,9.95 86.15,9.95 85.51,10.59 R11.1
  Bottom 0.305: v73.48,36.52 73.48,39.65 70.97,42.16 v67.56,42.16 | C12.1 C13.1 59.69,33.71 C11.1 60.66,32.33 v60.96,32.03 61.26,32.33 C14.1 62.81,33.02 C17.2 C16.1 C15.2 63.1,40.64 | C12.1 55.19,34.29 v55.19,33.02 C10.1 | v63.86,41.38 63.12,40.64 63.1,40.64 | v54.61,35.56 55.19,34.98 C12.1 | C8.1 54.24,40.22 54.25,40.23 54.82,40.23 v55.35,40.76 | v59.69,40.64 60.2,40.64 61.06,41.5 62.24,41.5 63.1,40.64 | C9.1 53.92,31.2 v53.54,31.58 | v76.2,53.34 76.2,49.53 74.93,48.26 v73.66,48.26 | v68.58,38.1 68.96,37.72 68.96,31.37 v69.85,30.48 | v51.69,46.46 49.76,46.46 v41.15,37.85
  Bottom 0.61: v34.29,29.21 v34.29,34.29 | v46.99,12.7 48.26,11.43 73.66,11.43 v74.93,12.7 v74.93,6.35
5V  (via drill 0.51)
  Top 0.61: C5.1 31.33,43.18 29.21,41.06 5VPOWER.3 30.48,39.37 v30.48,35.56 | v19.74,38.1 5V-2.2 5V.2
  Bottom 0.61: v30.48,35.56 33.02,33.02 LCD.3 | 5VPOWER.3 26.67,38.1 v19.74,38.1
12V
  Top 0.914: 3.3VPOWER.1 24.13,23.16 21.97,25.31 22.01,25.35 C20.1 21.97,27.98 21.97,35.35 24.13,37.51 5VPOWER.1 22.86,40.64 22.01,41.49 C6.1 21.84,48.26 19.05,51.05 JP3.1 12.7,45.72 12V.2
ADC  (via drill 0.51)
  Top 0.152: IC2.23 63.42,27.04 v64.45,26.01
  Bottom 0.152: v64.45,26.01 64.43,26.01 63.61,25.18 62.95,25.18 62.74,25.4 50.8,25.4 46.74,21.34 46.74,17.76 45.72,16.48 ADC.1
B/RSTA
  Top 0.305: BTN.1 48.26,40.68 48.88,40.06 IC2.79
B/STP
  Top 0.305: BTN.2 49.53,54.61 49.53,46.99 48.85,46.31 48.85,41.03 49.32,40.56 IC2.78
BOOT0
  Top 0.152: 44.24,30.73 44.2,30.73 44.24,30.69
  Top 0.305: IC2.94 46.11,32.56 44.24,30.69 | 44.24,30.73 44.24,30.69 | 44.24,30.69 44.24,29.63 R4.2 | 44.24,30.69 41.91,33.02 R7.1
BOOT1
  Top 0.305: R6.1 R5.1 76.2,41.91 69.35,35.06 IC2.37
EN  (via drill 0.51)
  Top 0.305: U2.3 85.55,29.67 v81.28,25.4 | v82.88,12.06 82.88,11.52 R13.2
  Bottom 0.305: v81.28,25.4 81.28,14.76 81.84,14.2 81.84,13.11 v82.88,12.06
GND  (via drill 0.51)
  Top 0.305: JP1.1 39.37,27.94 44.45,27.94 46.57,30.06 IC2.99 52.43,30.06 v52.43,33.15 | S2.1 85.8,50.8 | 85.8,50.8 85.8,47.93 JP2.1 | U2.15 75.55,19.39 73.8,17.64 73.66,17.64 | C18.2 67.89,25.98 68.58,26.67 v68.58,27.94 68.58,29.21 67.73,30.06 IC2.27 | v72.39,17.78 72.53,17.64 73.66,17.64 | IC2.10 56.92,29.44 v55.88,30.48 | IC2.74 52.92,41.96 55.06,39.82 | v57.15,39.37 55.51,39.37 55.06,39.82 | 71.12,52.07 C19.2 67.98,56.57 GND1.1 | 71.12,52.07 v71.12,50.8 | v54.61,39.37 55.06,39.82 | 55.06,39.82 | C1.2 55.46,49.95 v58.42,46.99 | C2.2 67.31,44.03 v67.31,45.72 v60.17,45.72 | 71.12,52.07 72.39,50.8 85.8,50.8 | 73.66,17.64 73.66,9.88 | 73.66,9.88 S1.1 | R14.2 76.9,9.88 73.66,9.88
  Top 0.61: 3.3VPOWER.2 26.67,27.61 C7.2 26.67,28.3 26.67,31.75 | 26.67,31.75 5VPOWER.2 27.09,41.06 27.09,44.45 C5.2 27.52,46.99 26.25,48.26 C6.2 23.71,49.95 JP3.2 | JP1.1 35.56,31.75 26.67,31.75 | C21.2 53.76,8.47 GND2.1 61.81,7.2 C22.2 v64.77,15.24
  Top 0.914: C20.2 27,27.94 C7.2 | GND.1 23.99,54.47 JP3.2
  Bottom 0.305: C12.2 C13.2 61.07,36.14 C17.1 C16.2 C15.1 60.38,39.37 v57.15,39.37 58.42,40.64 v58.42,46.99 58.9,46.99 v60.17,45.72 | 53.34,32.44 53.14,32.44 v52.43,33.15 52.43,30.81 C9.2 | 69.85,20.32 68.58,21.59 v68.58,27.94 68.58,29.21 66.62,31.17 C14.2 C11.2 58.42,29.9 C10.2 56.46,29.9 v55.88,30.48 53.92,32.44 53.34,32.44 | 69.85,20.32 v72.39,17.78 | v64.77,15.24 69.85,20.32 | v71.12,50.8 71.12,49.53 67.31,47.62 v67.31,45.72 | v54.61,39.37 53.76,38.52 C8.2 53.34,32.44
  Bottom 0.61: 3.3VPOWER.2 26.67,7.62 LCD.4
  Bottom 0.914: JP3.2 20.52,51 20.52,50.7 18.09,48.26 | 18.09,48.26 12V.1 | 18.09,48.26 14.76,44.93 | 14.76,44.93 10.46,40.64 5V-2.1 5V.1 | 14.76,44.93 14.76,36.83 | 14.76,36.83 14.76,33.81 3.3V.8 3.3V.6 3.3V.4 3.3V.2 | 14.76,36.83 17.54,34.05 17.54,30.24 LED_GND.3 LED_GND.2 LED_GND.1
L/ERR
  Top 0.152: LED.2 81.18,43.18 78.74,40.4 R2.1
L/PWR
  Top 0.152: LED.3 88.48,40.22 R3.1
L/WRK  (via drill 0.51)
  Top 0.152: R1.1 81.53,40.47 82.55,40.47 83.75,41.91 v83.82,41.91
  Bottom 0.152: v83.82,41.91 85.09,41.91 LED.1
N$1
  Top 0.152: IC2.29 69.32,31.06 69.52,31.27 72.51,31.27 73.06,31.82 82,31.82 84.62,34.44 84.62,37.85 85.29,38.52 R3.2
N$2  (via drill 0.51)
  Top 0.152: IC2.30 66.04,31.58 67.59,31.58 69.03,33.02 v71.12,33.02 | R2.2 74.08,38.52 v71.12,35.56
  Bottom 0.152: v71.12,33.02 v71.12,35.56
N$3
  Top 0.305: C22.1 60.11,17.18 Y1.1 63.25,20.57 58.42,25.4 IC2.13
N$4
  Top 0.152: IC2.31 67.49,32.06 69.54,34.11 78.29,34.11 78.48,34.3 78.48,37.27 78.78,37.57 80.05,37.57 R1.2
N$5  (via drill 0.51)
  Top 0.305: U2.18 81.55,20.05 v83.82,17.78 | v86.36,15.24 87.21,14.39 R11.2
  Bottom 0.305: v83.82,17.78 v86.36,15.24
N$6  (via drill 0.51)
  Top 0.305: U2.17 79.55,18.24 v80.01,17.78 | v80.01,15.24 80.01,13.12 R8.2
  Bottom 0.305: v80.01,17.78 v80.01,15.24
N$7  (via drill 0.51)
  Top 0.305: U2.16 77.55,17.86 v77.47,17.78 | v81.64,10.77 81.64,9.5 81.03,8.89 R14.1
  Bottom 0.305: v77.47,17.78 78.74,16.51 78.74,12.7 80.67,10.77 v81.64,10.77
N$10
  Top 0.305: IC2.12 57.92,25.66 53.59,21.34 Y1.2 53.59,17.11 C21.1
N$15
  Top 0.305: IC2.73 53.42,49.66 C1.1
N$16
  Top 0.305: JP2.2 81.9,46.57 80.01,46.57 R6.2
N$17
  Top 0.305: IC2.49 68.58,41.06 C2.1
N$19  (via drill 0.51)
  Top 0.305: IC2.20 61.92,26.98 62.93,25.97 v63.28,25.97
  Bottom 0.305: v63.28,25.97 62.8,26.45 49.31,26.45 46.12,23.26 46.12,18.65 43.18,15.71 J1.1
N$23
  Top 0.305: R4.1 38.52,31.33 JP1.2
NRST
  Top 0.305: IC2.14 58.92,26.89 59.36,26.46 61.57,26.46 63.21,24.82 64.48,24.82 | 64.48,24.82 C18.1 69.58,24.82 R9.1 69.85,23.84 71.4,22.29 71.4,12.14 70.9,11.65 S1.3 | NRST.1 66.32,9.17 66.32,22.98 64.48,24.82
P/PUMP
  Top 0.152: IC2.82 48.36,38.56 40.06,46.86 40.06,55.3 P/S.2
P/RLY
  Top 0.152: IC2.81 48.44,39.06 42.48,45.02 42.48,55.18 P/S.1
PA7  (via drill 0.51)
  Top 0.152: IC2.32 66.04,32.58 66.96,32.58 68.06,33.69 v68.06,33.89
  Bottom 0.152: v68.06,33.89 67.78,34.17 67.78,40.83 65.51,43.11 65.51,53.34 65.51,53.87 TEST.4
PA13  (via drill 0.51)
  Top 0.152: IC2.72 53.94,43.18 53.94,46.64 54.51,47.21 v55.88,47.21 | v58.42,52.17 58.8,51.79 64.46,51.79 71.8,44.45 v72.39,44.45 | v76.35,2.06 76.12,1.83 67.31,1.83 67.06,1.83 57.86,1.83 STL.3
  Bottom 0.152: v55.88,47.21 58.42,49.75 v58.42,52.17 | v72.39,44.45 73.66,43.18 73.66,41.42 76.12,38.96 76.12,2.28 v76.35,2.06
PA14  (via drill 0.51)
  Top 0.152: IC2.76 50.82,44.1 50.47,44.45 v50.14,44.45 | v49.61,28.1 49.33,27.82 49.33,15.06 49.96,14.43 49.96,7.19 STL.2
  Bottom 0.152: v50.14,44.45 50.14,28.63 v49.61,28.1
PB0  (via drill 0.51)
  Top 0.152: IC2.35 v64.14,34.06 v64.13,34.06
  Bottom 0.152: v64.13,34.06 63.58,34.62 63.58,39.98 64.65,41.05 64.65,41.7 60.96,45.39 TEST.3
PB1  (via drill 0.51)
  Top 0.152: IC2.36 65.9,34.68 65.13,34.68 64.28,35.53 v64.28,38.02 | v62.23,53.34 59.69,53.34 58.42,54.61 TEST.2
  Bottom 0.152: v64.28,38.02 64.28,40.25 64.95,40.92 64.95,45.76 63.5,47.21 63.5,52.07 v62.23,53.34
PB3  (via drill 0.51)
  Top 0.152: IC2.89 50.84,35.04 51.76,35.04 52.99,33.81 55.52,33.81 59.47,29.85 v59.79,29.85 | v47.8,27.21 47.8,6.81 STL.1
  Bottom 0.152: v47.8,27.21 51.2,27.21 51.93,27.94 57.88,27.94 v59.79,29.85
PC12  (via drill 0.51)
  Top 0.152: IC2.80 50.8,39.58 48.68,39.58 45.81,42.45 v45.81,49.53
  Bottom 0.152: TEST.1 54.61,55.88 49.53,50.8 47.08,50.8 v45.81,49.53
RESET
  Top 0.305: U2.1 89.55,35.84 90.54,36.83 90.54,52.13 S2.3 84.25,58.42 75.35,58.42 R10.1 71.39,58 C19.1
RX2  (via drill 0.51)
  Top 0.305: v72.39,24.13 72.88,24.13 73.03,23.98 86.18,23.98 88.56,21.61 88.56,21.43 U2.22 89.55,7 86.36,3.81 ESP.1 | v69.85,21.59 v67.31,21.59 | IC2.26 67.31,28.27 v67.31,27.94
  Bottom 0.305: v72.39,24.13 v69.85,21.59 | v67.31,21.59 v67.31,27.94
SCL  (via drill 0.51)
  Top 0.305: IC2.92 48.99,33.56 47.41,35.13 44.7,35.13 v43.43,36.41
  Bottom 0.305: v43.43,36.41 43.43,20.57 43.18,20.32 43.18,16.5 42.62,15.94 42.62,8.33 LCD.1
SDA  (via drill 0.51)
  Top 0.305: IC2.93 45.05,33.06 v44.83,32.84 | v44.45,19.05 35.56,10.16 LCD.2
  Bottom 0.305: v44.83,32.84 44.83,19.43 v44.45,19.05
SOL1
  Top 0.152: IC2.83 50.78,38.1 48.26,38.1 38.1,48.26 P/S.3
SOL2
  Top 0.152: IC2.84 48.16,37.56 35.56,50.16 P/S.4
SOL3
  Top 0.152: IC2.85 48.03,37.06 33.02,52.07 P/S.5
SOL4
  Top 0.152: P/S.6 30.48,53.34 47.27,36.55 IC2.86
SOLAIR
  Top 0.152: P/S.7 27.94,53.34 45.19,36.09 50.79,36.09 IC2.87
TX2  (via drill 0.51)
  Top 0.305: U2.21 87.55,18.97 85.09,16.51 v74.93,16.51 | IC2.25 66.02,27.96 v66.04,27.94 | v67.31,12.7 67.31,7.62 69.85,5.08 78.74,5.08 ESP.2
  Bottom 0.305: v74.93,16.51 71.12,16.51 | 71.12,16.51 69.85,16.51 66.04,12.7 64.77,12.7 63.5,13.97 63.5,15.19 66.04,17.73 v66.04,27.94 | 71.12,16.51 v67.31,12.7

### Text on the board
tPlace: SolAir | Sol4 | Sol3 | Sol2 | Sol1 | Pump / PWR | Relay / PWR | Restart | Stop | PC12 | PB1 | PB0 | PA7 | ECE477 / Team19 / Apr.08th / Ver4.0 | GND | 12V | LED / WRK | LED / ERR | GND | LED / PWR | 5V | GND | 3.3V | GND | 3.3V | Team / Members: / Ni Kang / Haoming Zhang / Taihai He / Yifu Ding | GND | SDA | SCL | VSSA | ADC | PB3 | PA14 | PA13 | GND | NRST | TX2 | RX2 | VCC / 5V
tNames: C9